# EAGLE design rony_4_hall_sensor (EAGLE 8.2.0)
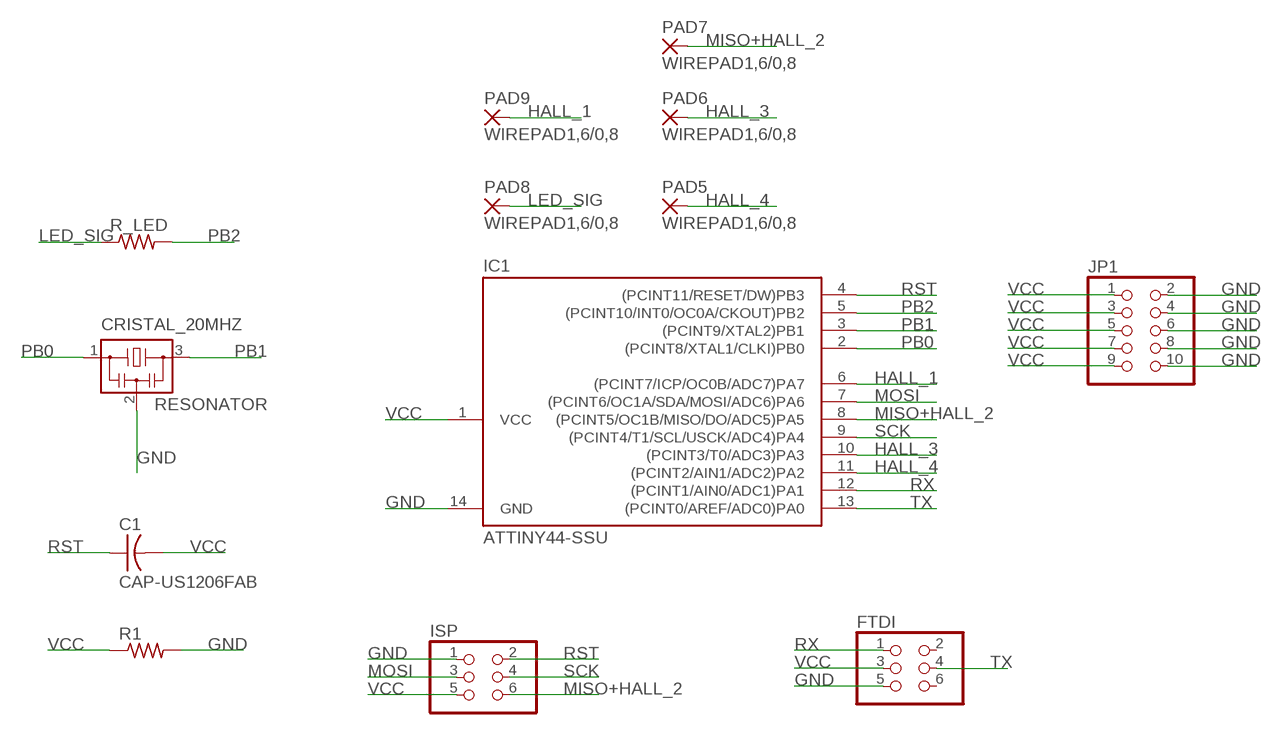
[diagram p0: schematic, sheet 1]

## Parts
C1  CAP-US1206FAB  [C1206FAB]
CRISTAL_20MHZ  RESONATOR  [EFOBM]
FTDI  PINHD-2X3-SMD  [2X03SMD]
IC1  ATTINY44-SSU  [SOIC14]
ISP  PINHD-2X3-SMD  [2X03SMD]
JP1  PINHD-2X5  [2X05]
PAD5  WIREPAD1,6/0,8  [1,6/0,8]
PAD6  WIREPAD1,6/0,8  [1,6/0,8]
PAD7  WIREPAD1,6/0,8  [1,6/0,8]
PAD8  WIREPAD1,6/0,8  [1,6/0,8]
PAD9  WIREPAD1,6/0,8  [1,6/0,8]
R1  RES-US1206FAB  [R1206FAB]
R_LED  RES-US1206FAB  [R1206FAB]

## Nets
GND: CRISTAL_20MHZ.2 FTDI.5 IC1.14(GND) ISP.1 JP1.2 JP1.4 JP1.6 JP1.8 JP1.10 R1.2
HALL_1: IC1.6((PCINT7/ICP/OC0B/ADC7)PA7) PAD9.1(P)
HALL_3: IC1.10((PCINT3/T0/ADC3)PA3) PAD6.1(P)
HALL_4: IC1.11((PCINT2/AIN1/ADC2)PA2) PAD5.1(P)
LED_SIG: PAD8.1(P) R_LED.1
MISO+HALL_2: IC1.8((PCINT5/OC1B/MISO/DO/ADC5)PA5) ISP.6 PAD7.1(P)
MOSI: IC1.7((PCINT6/OC1A/SDA/MOSI/ADC6)PA6) ISP.3
PB0: CRISTAL_20MHZ.1 IC1.2((PCINT8/XTAL1/CLKI)PB0)
PB1: CRISTAL_20MHZ.3 IC1.3((PCINT9/XTAL2)PB1)
PB2: IC1.5((PCINT10/INT0/OC0A/CKOUT)PB2) R_LED.2
RST: C1.1 IC1.4((PCINT11/RESET/DW)PB3) ISP.2
RX: FTDI.1 IC1.12((PCINT1/AIN0/ADC1)PA1)
SCK: IC1.9((PCINT4/T1/SCL/USCK/ADC4)PA4) ISP.4
TX: FTDI.4 IC1.13((PCINT0/AREF/ADC0)PA0)
VCC: C1.2 FTDI.3 IC1.1(VCC) ISP.5 JP1.1 JP1.3 JP1.5 JP1.7 JP1.9 R1.1
Unconnected: FTDI.2 FTDI.6

## Library data of the parts
C1 = fab:CAP-US
CRISTAL_20MHZ = fab:RESONATOR
FTDI ISP = fab:PINHD-2X3-SMD: PIN HEADER
IC1 = fab:ATTINY44
JP1 = pinhead:PINHD-2X5: PIN HEADER
PAD5-PAD9 = wirepad:WIREPAD: Wire PAD connect wire on PCB
R1 R_LED = fab:RES-US: Resistor (US Symbol) Variants with postfix FAB are widened to allow the routing of internal traces

## Board
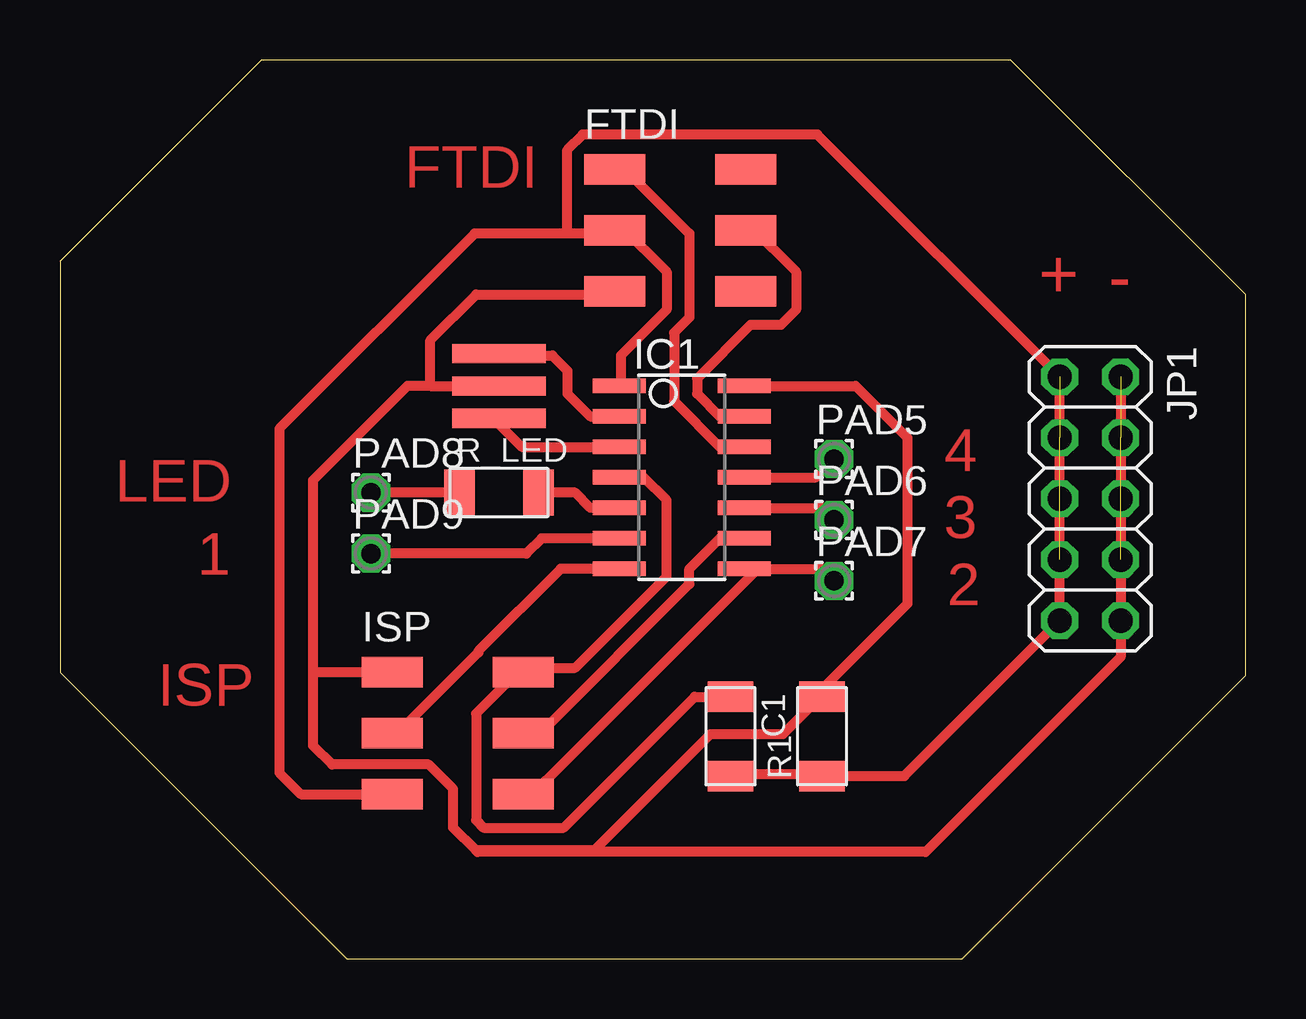
[diagram p1: board, top side]

Size 49.4 x 37.46 mm. Coordinates in mm from the lower left corner, seen from the top.
Outline: 37.59,0 49.4,11.81 49.4,27.69 39.62,37.46 8.38,37.46 0,29.08 0,11.94 11.94,0 37.59,0
Copper layers (1*16): Top 0.035mm / dielectric 1.5mm / Bottom 0.035mm
Design rules "4_hall_sensor": minimum track width 16mil, minimum drill 0.35mm, track to track 16mil, track to pad 0.4mm, pad to pad 0.205mm, via to via 0.205mm, smd to smd 6mil, copper to edge 0.6mm, drill to drill 6mil, minimum pad ring 10mil, minimum via ring 8mil, stop-mask expansion 4mil, vias tented up to drill 0mil, thermal gap 10mil

### Footprints (pad centres in the part's own frame; a part is rotated, then mirrored left to right if it is on the bottom)
C1206FAB = smd 1.27 x 1.905: 1 -1.651,0; 2 1.651,0
EFOBM = smd 0.8 x 3.9: 1 -1.35,0; 2 0,0; 3 1.35,0
2X03SMD = smd 2.54 x 1.27: 1 -2.54,2.54; 2 2.92,2.54; 3 -2.54,0; 4 2.92,0; 5 -2.54,-2.54; 6 2.92,-2.54
SOIC14 = smd 0.61 x 2.21: 1 -3.81,-2.603; 2 -2.54,-2.603; 3 -1.27,-2.603; 4 0,-2.603; 5 1.27,-2.603; 6 2.54,-2.603; 7 3.81,-2.603; 8 3.81,2.603; 9 2.54,2.603; 10 1.27,2.603; 11 0,2.603; 12 -1.27,2.603; 13 -2.54,2.603; 14 -3.81,2.603
2X05 = drill 1.016 octagon: 1 -5.08,-1.27; 2 -5.08,1.27; 3 -2.54,-1.27; 4 -2.54,1.27; 5 0,-1.27; 6 0,1.27; 7 2.54,-1.27; 8 2.54,1.27; 9 5.08,-1.27; 10 5.08,1.27
1,6/0,8 = drill 0.813 pad 1.6 octagon: 1 0,0
R1206FAB = smd 1.27 x 1.905: 1 -1.651,0; 2 1.651,0

### Placement (x,y rotation side)
C1  27.94,9.27 270 top
CRISTAL_20MHZ  18.29,23.88 270 top
FTDI  25.65,30.35 0 top
IC1  25.91,20.07 270 top
ISP  16.38,9.4 0 top
JP1  42.93,19.18 270 top
PAD5  32.26,20.83 0 top
PAD6  32.26,18.29 0 top
PAD7  32.26,15.75 0 top
PAD8  12.95,19.43 0 top
PAD9  12.95,16.89 0 top
R1  31.75,9.27 90 top
R_LED  18.29,19.43 0 top

### Tracks (layer width: path | path; a pad name or v marks a point on that pad's centre or on a via)
GND  (3 unrouted)
  Top 0.406: 15.43,23.88 CRISTAL_20MHZ.2 | 15.43,23.88 14.48,23.88 10.54,19.94 10.54,11.94 | 15.43,23.88 15.43,25.78 17.34,27.69 23.05,27.69 FTDI.5 | 17.34,4.51 16.38,5.46 16.38,7.08 15.36,8.1 11.34,8.1 10.54,8.89 10.54,11.94 | 17.34,4.51 22.26,4.51 27.11,9.37 30.13,9.37 31.62,10.86 R1.2 31.75,11.24 35.31,14.79 35.31,21.72 33.15,23.88 IC1.14 | 13.84,12.06 ISP.1 10.54,11.94 | 17.34,4.51 17.4,4.45 36.07,4.45 44.2,12.57 JP1.10 JP1.2
HALL_1
  Top 0.406: IC1.6 20.07,17.53 19.43,16.89 PAD9.1
HALL_3
  Top 0.406: IC1.10 31.75,18.8 PAD6.1
HALL_4
  Top 0.406: IC1.11 31.5,20.07 PAD5.1
LED_SIG
  Top 0.406: R_LED.1 PAD8.1
MISO+HALL_2
  Top 0.406: IC1.8 29.08,16.26 20.83,8 19.78,6.98 19.72,7.05 ISP.6 19.56,7.05 | 28.77,16.26 IC1.8 | IC1.8 31.75,16.26 PAD7.1
MOSI
  Top 0.406: ISP.3 14.06,9.4 17.43,12.77 17.43,12.82 20.86,16.26 IC1.7
PB0
  Top 0.406: IC1.2 22.1,22.61 21.15,23.56 21.15,24.51 20.51,25.15 18.29,25.15 CRISTAL_20MHZ.1
PB1
  Top 0.406: IC1.3 19.24,21.34 18.29,22.29 CRISTAL_20MHZ.3
PB2
  Top 0.406: R_LED.2 21.46,19.43 22.1,18.8 IC1.5
RST
  Top 0.406: IC1.4 24.32,20.07 25.27,19.11 25.27,15.94 21.46,12.13 19.56,12.13 ISP.2 19.24,12.13 17.34,10.22 17.34,5.78 17.65,5.46 20.99,5.46 26.45,10.92 C1.1
RX
  Top 0.406: IC1.12 27.5,21.34 25.59,23.24 25.59,26.1 26.23,26.73 26.23,30.23 23.37,33.08 FTDI.1
SCK
  Top 0.406: IC1.9 27.5,17.53 26.23,16.26 26.23,15.62 20.19,9.59 19.56,9.59 ISP.4
TX
  Top 0.406: IC1.13 27.5,22.61 26.54,23.56 26.54,24.19 28.77,26.42 30.04,26.42 30.67,27.05 30.67,28.64 28.77,30.54 FTDI.4
VCC  (3 unrouted)
  Top 0.406: IC1.1 23.37,23.88 23.37,25.15 25.27,27.05 25.27,28.64 23.37,30.54 FTDI.3 23.05,30.23 21.15,30.23 | 21.15,30.23 21.15,33.72 21.78,34.35 31.56,34.35 JP1.1 JP1.9 35.18,7.62 R1.1 31.62,7.68 27.97,7.68 C1.2 | ISP.5 10.03,6.86 9.14,7.75 9.14,22.1 17.27,30.23 21.15,30.23

### Text on the board
Top: FTDI | + | - | 4 | LED | 3 | 1 | 2 | ISP